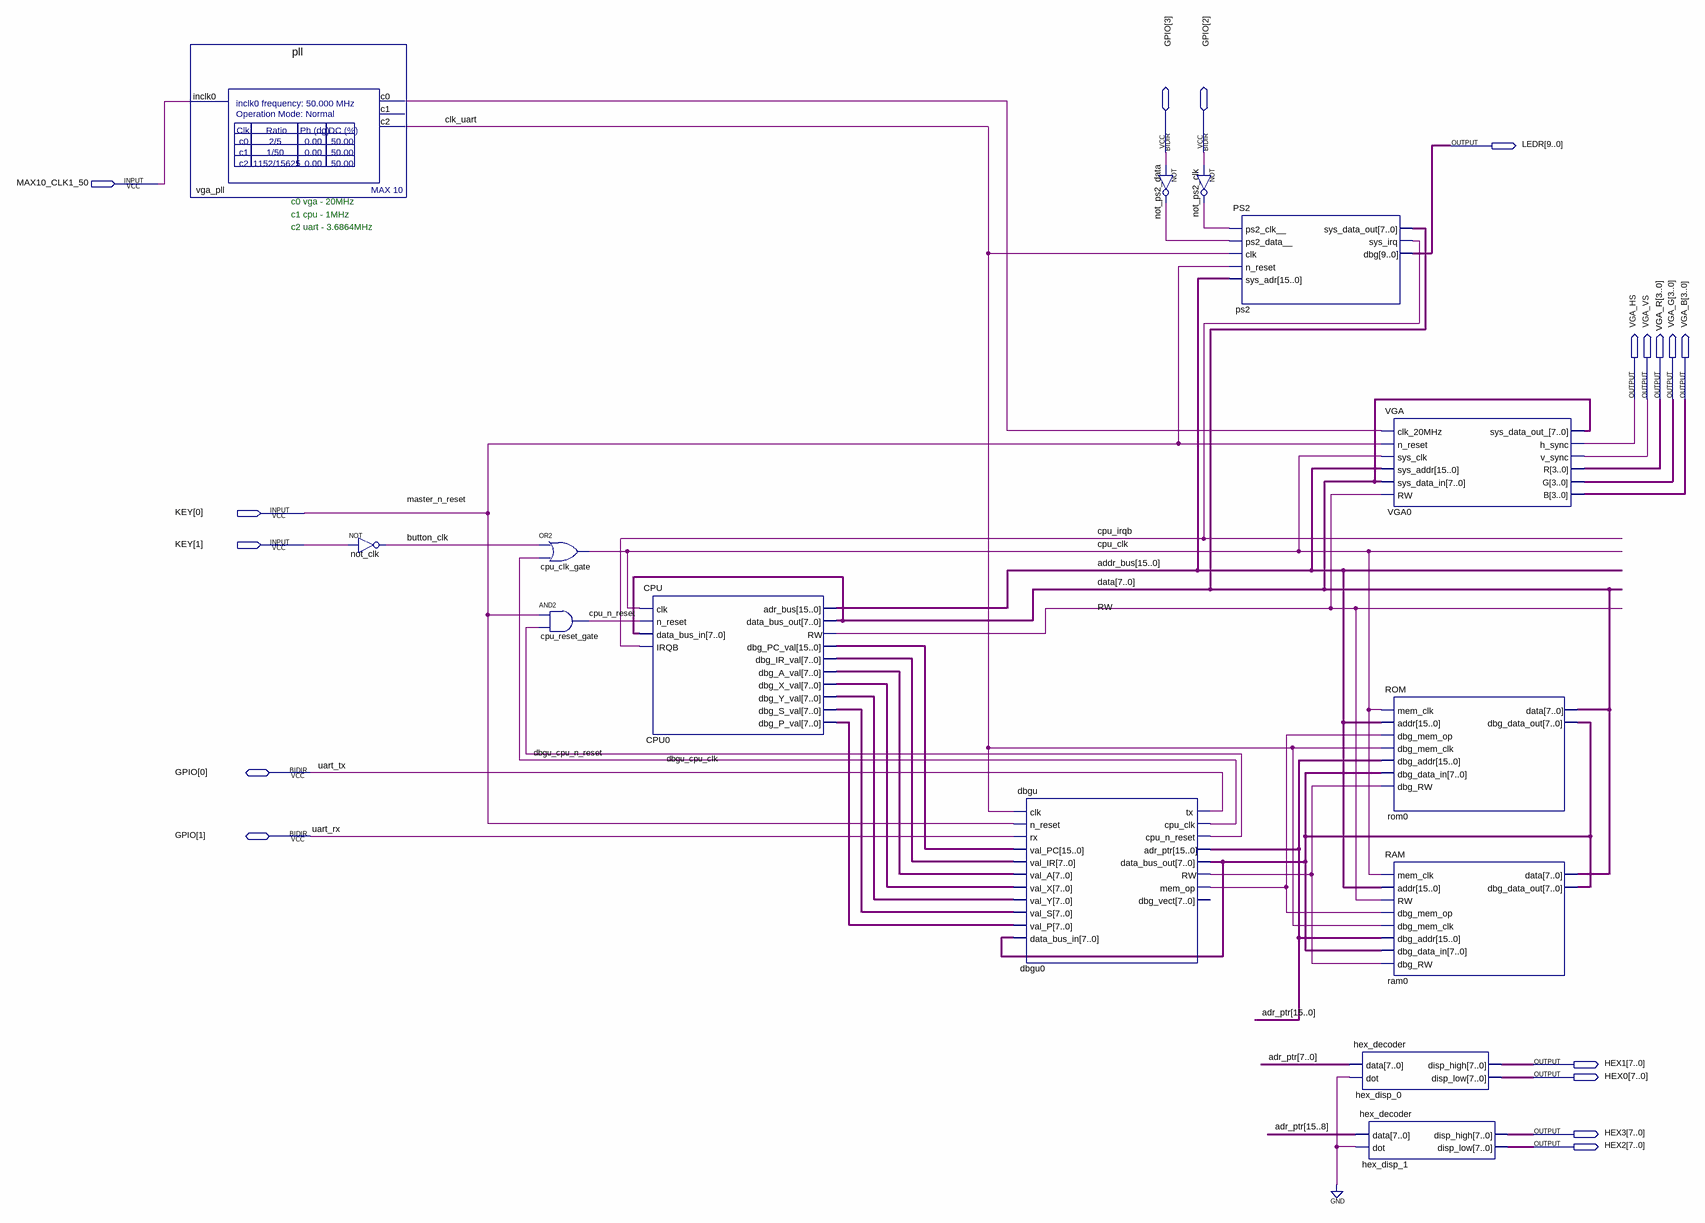
[diagram p0: schematic sheet]
// Quartus schematic main.bdf as structural Verilog: 14 symbols, 17 pins
module main (
  input  MAX10_CLK1_50,
  input  [1:0] KEY,
  inout  [3:0] GPIO,
  output [9:0] LEDR,
  output VGA_HS,
  output VGA_VS,
  output [3:0] VGA_R,
  output [3:0] VGA_G,
  output [3:0] VGA_B,
  output [7:0] HEX1,
  output [7:0] HEX0,
  output [7:0] HEX3,
  output [7:0] HEX2
);

  wire button_clk, clk_uart, cpu_clk, cpu_irqb, cpu_n_reset, dbgu0_mem_op, dbgu0_rw, dbgu_cpu_clk,
       dbgu_cpu_n_reset, not_ps2_clk_out, not_ps2_data_out, RW, vga_pll_c0;
  wire [7:0] CPU0_dbg_a_val, CPU0_dbg_ir_val, CPU0_dbg_p_val, CPU0_dbg_s_val, CPU0_dbg_x_val, CPU0_dbg_y_val,
       data, dbgu0_data_bus_out;
  wire [15:0] addr_bus, adr_ptr, CPU0_dbg_pc_val;

  pll vga_pll (.inclk0(MAX10_CLK1_50), .c0(vga_pll_c0), .c2(clk_uart));  // open: c1
  not not_clk (button_clk, KEY[1]);
  or cpu_clk_gate (cpu_clk, button_clk, dbgu_cpu_clk);
  and cpu_reset_gate (cpu_n_reset, KEY[0], dbgu_cpu_n_reset);
  CPU CPU0 (
    .clk(cpu_clk), .n_reset(cpu_n_reset), .data_bus_in(data), .IRQB(cpu_irqb), .adr_bus(addr_bus),
    .data_bus_out(data), .RW(RW), .dbg_PC_val(CPU0_dbg_pc_val), .dbg_IR_val(CPU0_dbg_ir_val),
    .dbg_A_val(CPU0_dbg_a_val), .dbg_X_val(CPU0_dbg_x_val), .dbg_Y_val(CPU0_dbg_y_val),
    .dbg_S_val(CPU0_dbg_s_val), .dbg_P_val(CPU0_dbg_p_val));
  dbgu dbgu0 (
    .clk(clk_uart), .n_reset(KEY[0]), .rx(GPIO[1]), .val_PC(CPU0_dbg_pc_val), .val_IR(CPU0_dbg_ir_val),
    .val_A(CPU0_dbg_a_val), .val_X(CPU0_dbg_x_val), .val_Y(CPU0_dbg_y_val), .val_S(CPU0_dbg_s_val),
    .val_P(CPU0_dbg_p_val), .data_bus_in(dbgu0_data_bus_out), .tx(GPIO[0]), .cpu_clk(dbgu_cpu_clk),
    .cpu_n_reset(dbgu_cpu_n_reset), .adr_ptr(adr_ptr), .data_bus_out(dbgu0_data_bus_out), .RW(dbgu0_rw),
    .mem_op(dbgu0_mem_op));  // open: dbg_vect
  not not_ps2_data (not_ps2_data_out, GPIO[3]);
  not not_ps2_clk (not_ps2_clk_out, GPIO[2]);
  PS2 ps2 (
    .ps2_clk__(not_ps2_clk_out), .ps2_data__(not_ps2_data_out), .clk(clk_uart), .n_reset(KEY[0]),
    .sys_adr(addr_bus), .sys_data_out(data), .sys_irq(cpu_irqb), .dbg(LEDR));
  VGA VGA0 (
    .clk_20MHz(vga_pll_c0), .n_reset(KEY[0]), .sys_clk(cpu_clk), .sys_addr(addr_bus), .sys_data_in(data),
    .RW(RW), .sys_data_out_(data), .h_sync(VGA_HS), .v_sync(VGA_VS), .R(VGA_R), .G(VGA_G), .B(VGA_B));
  ROM rom0 (
    .mem_clk(cpu_clk), .addr(addr_bus), .dbg_mem_op(dbgu0_mem_op), .dbg_mem_clk(clk_uart),
    .dbg_addr(adr_ptr), .dbg_data_in(dbgu0_data_bus_out), .dbg_RW(dbgu0_rw), .data(data),
    .dbg_data_out(dbgu0_data_bus_out));
  RAM ram0 (
    .mem_clk(cpu_clk), .addr(addr_bus), .RW(RW), .dbg_mem_op(dbgu0_mem_op), .dbg_mem_clk(clk_uart),
    .dbg_addr(adr_ptr), .dbg_data_in(dbgu0_data_bus_out), .dbg_RW(dbgu0_rw),
    .dbg_data_out(dbgu0_data_bus_out), .data(data));
  hex_decoder hex_disp_0 (.data(adr_ptr[7:0]), .dot(1'b0), .disp_high(HEX1), .disp_low(HEX0));
  hex_decoder hex_disp_1 (.data(adr_ptr[15:8]), .dot(1'b0), .disp_high(HEX3), .disp_low(HEX2));

  // Other names for the same wires on the sheet: master_n_reset = KEY[0]; uart_rx = GPIO[1]; uart_tx = GPIO[0]

  // Notes on the sheet:
  //   c0 vga - 20MHz
  //   c1 cpu - 1MHz
  //   c2 uart - 3.6864MHz
endmodule
